# EasyEDA schematic SCH_Timer_2026-05-08.json
TITLE: Sheet_1; REV: 1.0; Date: 2026-05-08; Sheet: 1/1; Drawn By: pramiskwr123; Company: Your Company
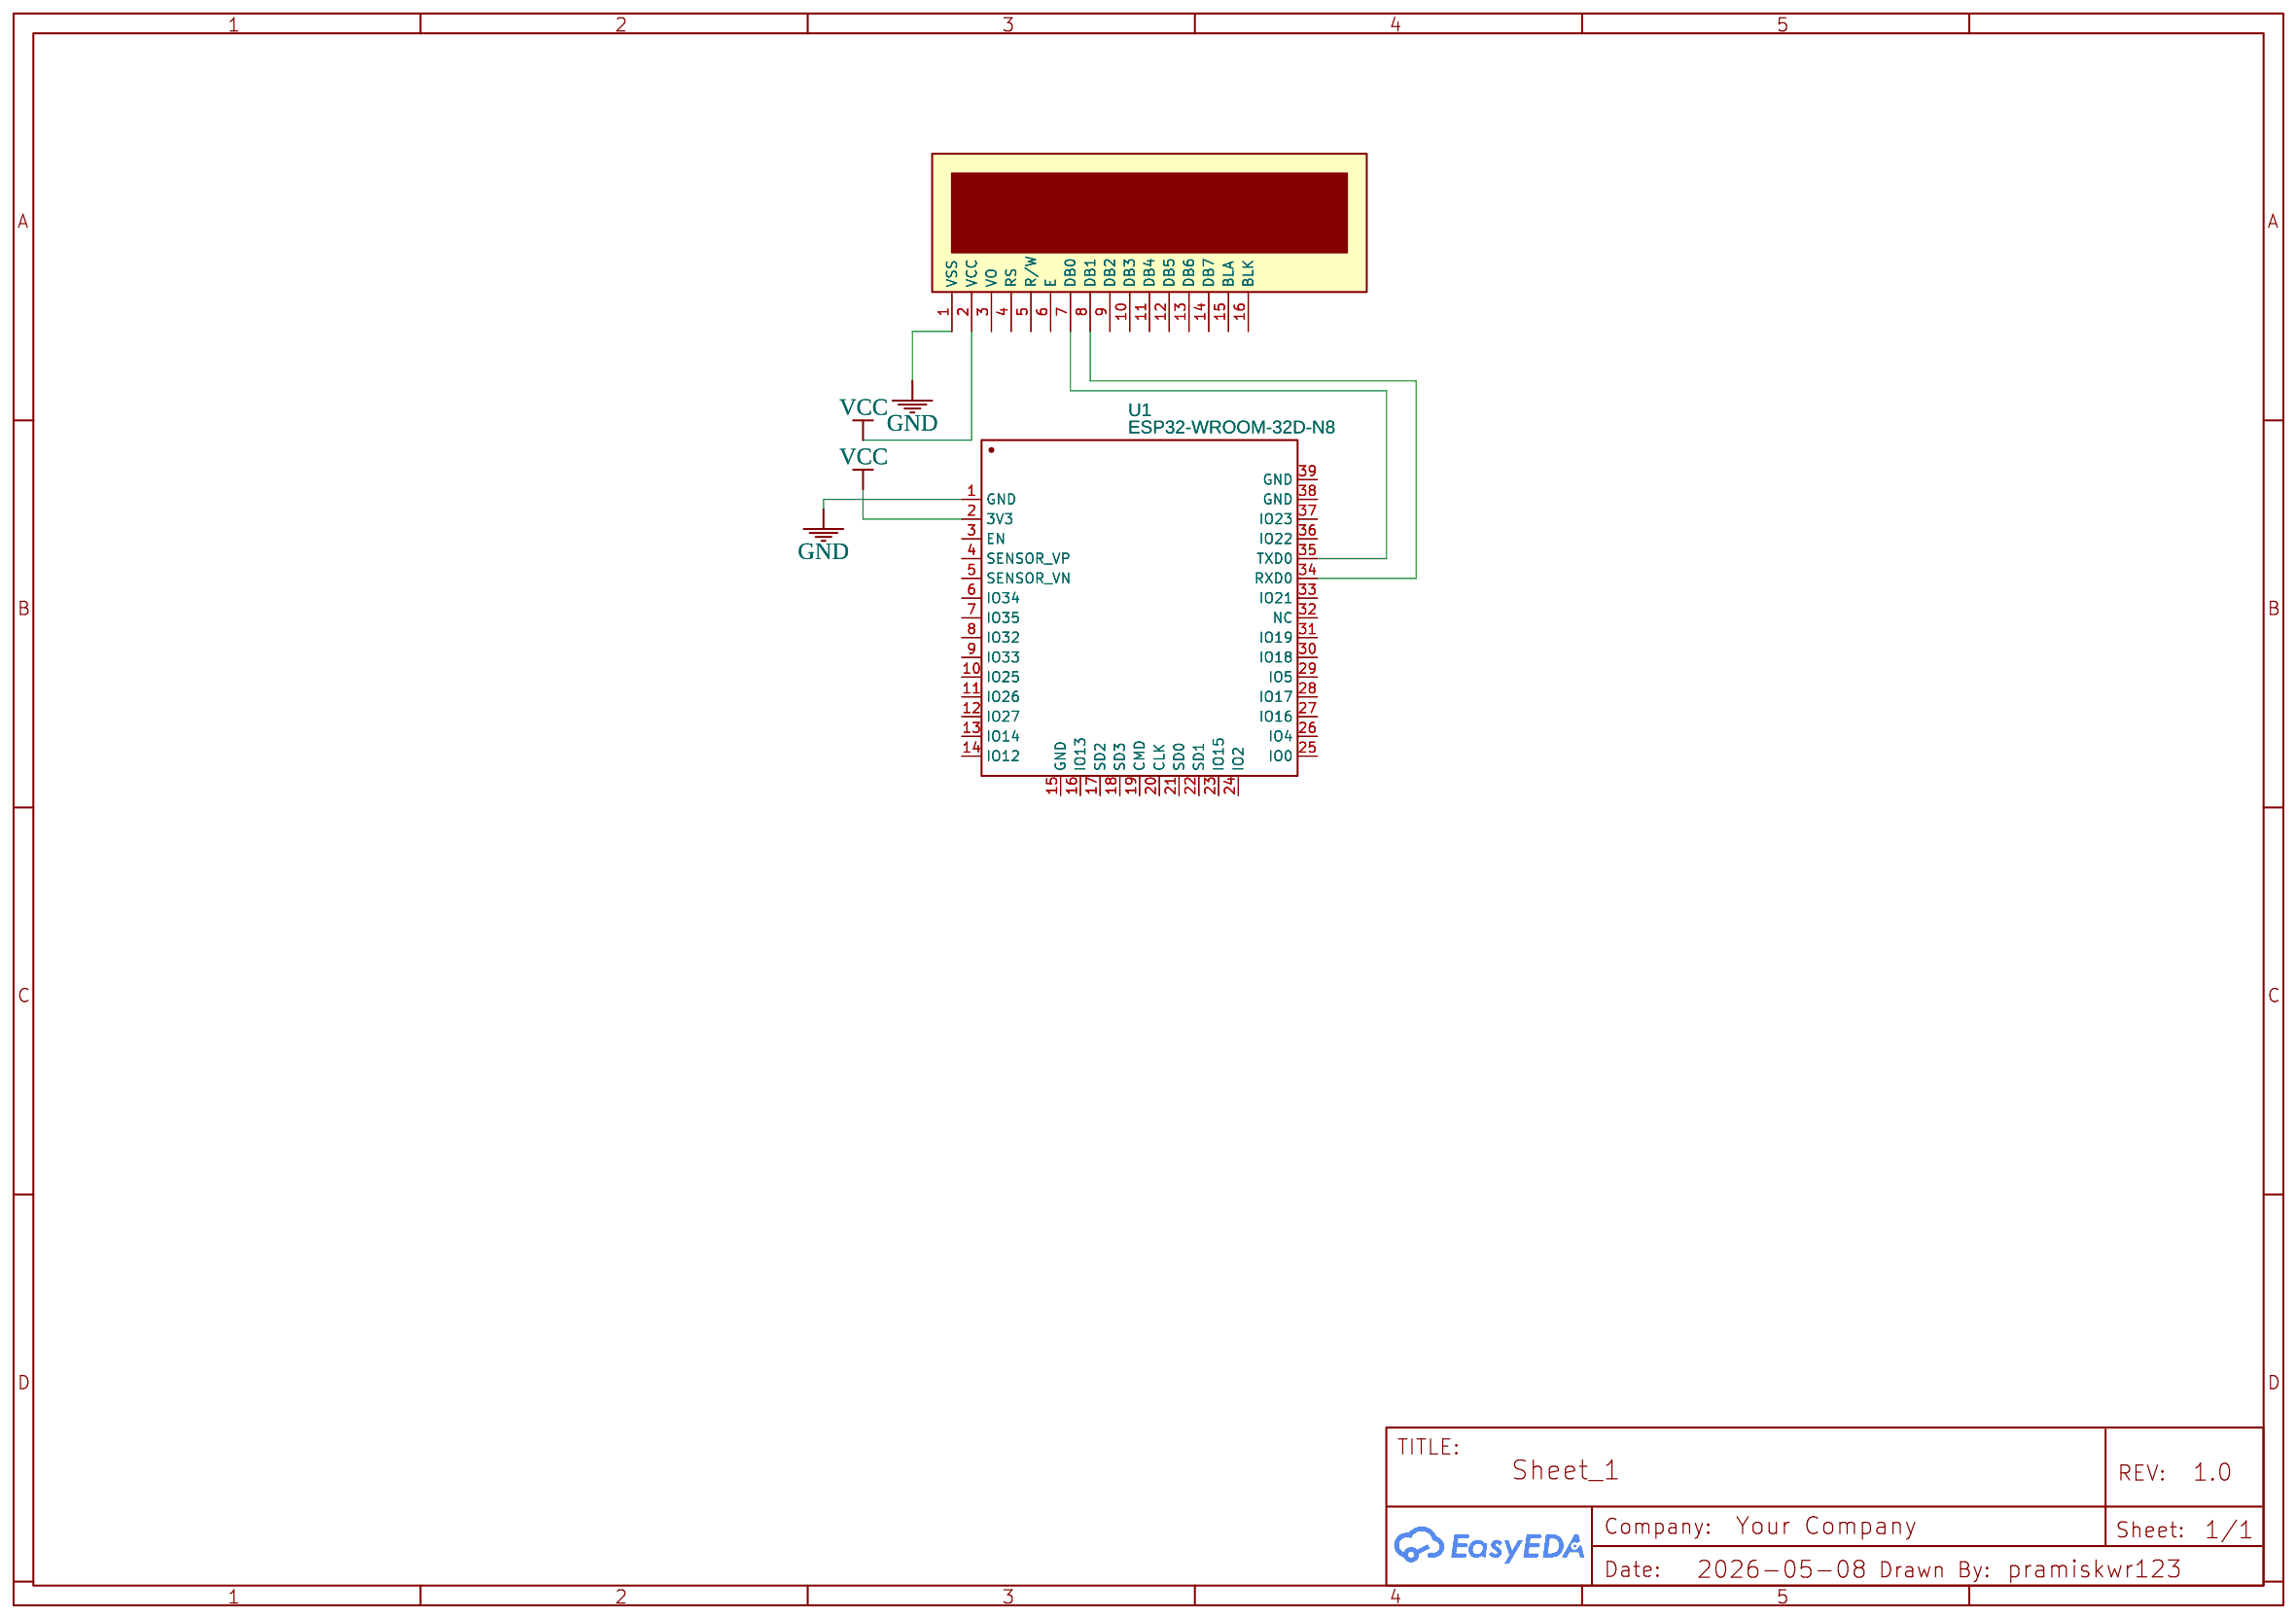
[diagram p0: schematic sheet]

## Parts
LCD1  LCD1602  [LCD1602]
U1  ESP32-WROOM-32D-N8  [WIFIM-SMD_ESP32-WROOM-32D]

## Library data of the parts
LCD1 = LCD1602: Manufacturer: LONTECH(厦门龙特); Manufacturer Part: LCM1602K-NSW-BBW; Supplier Part: C83275; Supplier: LCSC; Contributor: LCEDA_Lib
U1 = ESP32-WROOM-32D-N8: Contributor: lcsc; Supplier: LCSC; Supplier Part: C2973677; Manufacturer: null; Manufacturer Part: ESP32-WROOM-32D-N8-被合并; JLCPCB Part Class: Extended Part

## Nets
GND: LCD1.1(VSS) U1.1(GND)
VCC: LCD1.2(VCC) U1.2(3V3)
Net-(LCD1-7): LCD1.7(DB0) U1.35(TXD0)
Net-(LCD1-8): LCD1.8(DB1) U1.34(RXD0)

Not connected (* = marked no-connect by the designer): LCD1 3(VO) 4(RS) 5(R/W) 6(E) 9(DB2) 10(DB3) 11(DB4) 12(DB5) 13(DB6) 14(DB7) 15(BLA) 16(BLK); U1 3(EN) 4(SENSOR_VP) 5(SENSOR_VN) 6(IO34) 7(IO35) 8(IO32) 9(IO33) 10(IO25) 11(IO26) 12(IO27) 13(IO14) 14(IO12) 15(GND) 16(IO13) 17(SD2) 18(SD3) 19(CMD) 20(CLK) 21(SD0) 22(SD1) 23(IO15) 24(IO2) 25(IO0) 26(IO4) 27(IO16) 28(IO17) 29(IO5) 30(IO18) 31(IO19) 32(NC) 33(IO21) 36(IO22) 37(IO23) 38(GND) 39(GND)
